# Altium schematic sheet 333-2SURD_S530-A31_333-2SURD_S530-A3.schdoc
size 127 x 99 mm
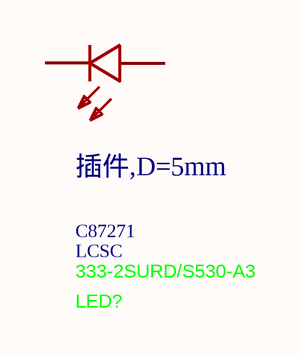
[diagram p0: 333-2SURD_S530-A31_333-2SURD_S530-A3.schdoc]

## Parts
LED?  333-2SURD/S530-A3  Supplier: LCSC  Supplier Part: C87271  Supplier Footprint: 插件,D=5mm  [LED-TH_BD5.9-P2.54-RD_RED]

## Nets

Not connected (* = marked no-connect by the designer): LED? 1(C) 2(A)

## Library data of the parts
LED? = 333-2SURD/S530-A3: Manufacturer: EVERLIGHT(亿光); Lamp Holder Type: 5 mm round LED; Add into BOM: yes; Illumination Color: Red; Voltage - Forward(Vf): 2V; Forward Current: 20mA; Wavelength - Dominant: 624nm; Peak Wavelength: 632nm; Lens Color: Red Lens; Luminous Intensity: 200mcd; Viewing Angle: 30°; Symbol: 333-2SURD/S530-A3; Device: 333-2SURD/S530-A3; Manufacturer Part: 333-2SURD/S530-A3; LCSC Part Name: 5mm圆形灯头 红色; JLCPCB Part Class: Extended Part; Datasheet: https://en.everlight.com/wp-content/plugins/ItemRelationship/product_files/pdf/333-2SURD-S530-A3.pdf; Convert to PCB: yes